# EAGLE board ExiaNona (EAGLE 9.6.2)
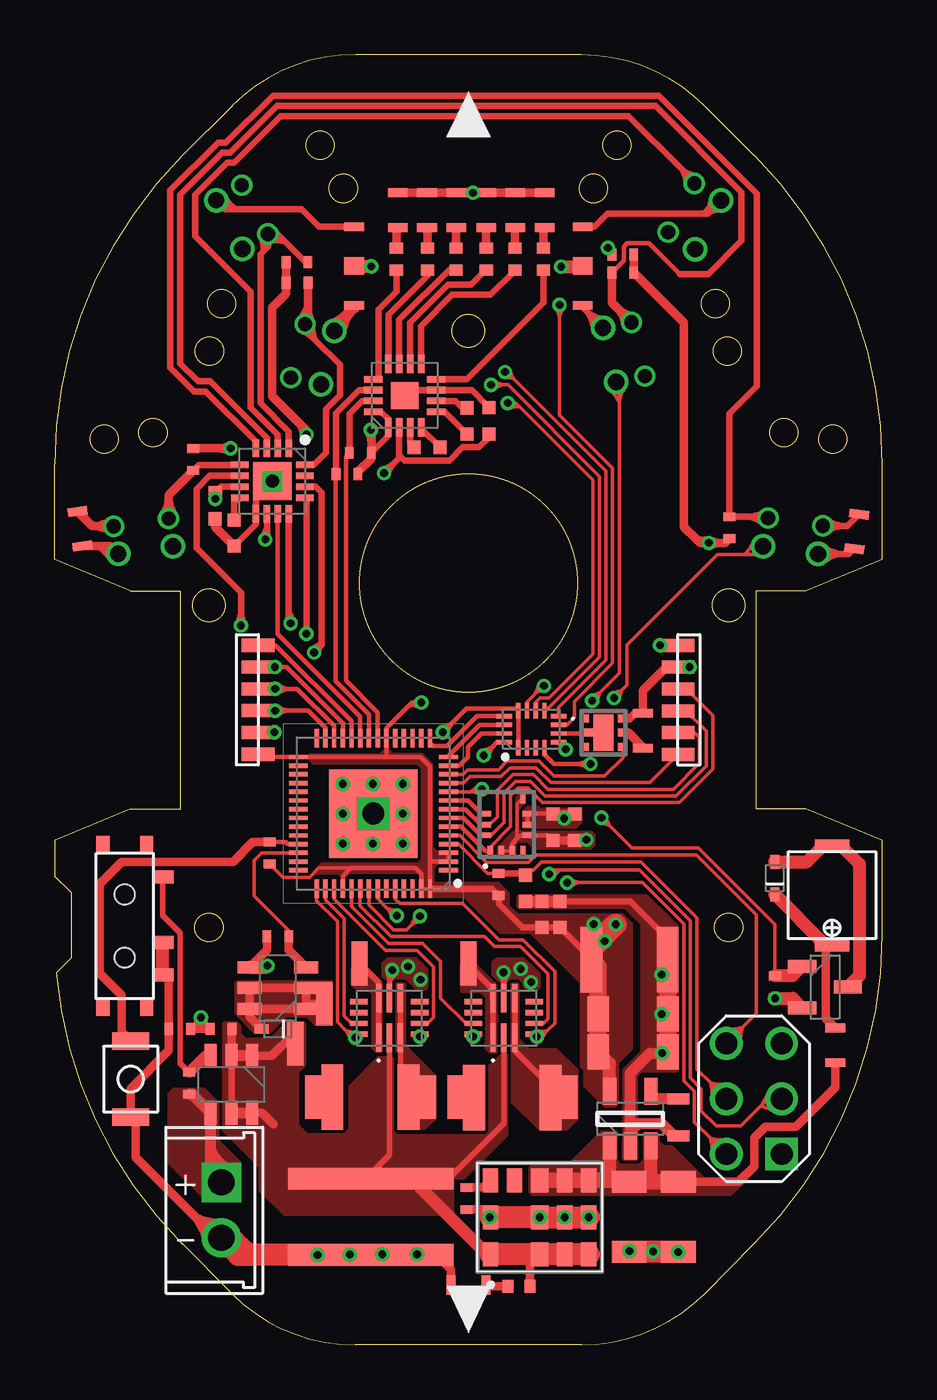
[diagram p2: board, top side]
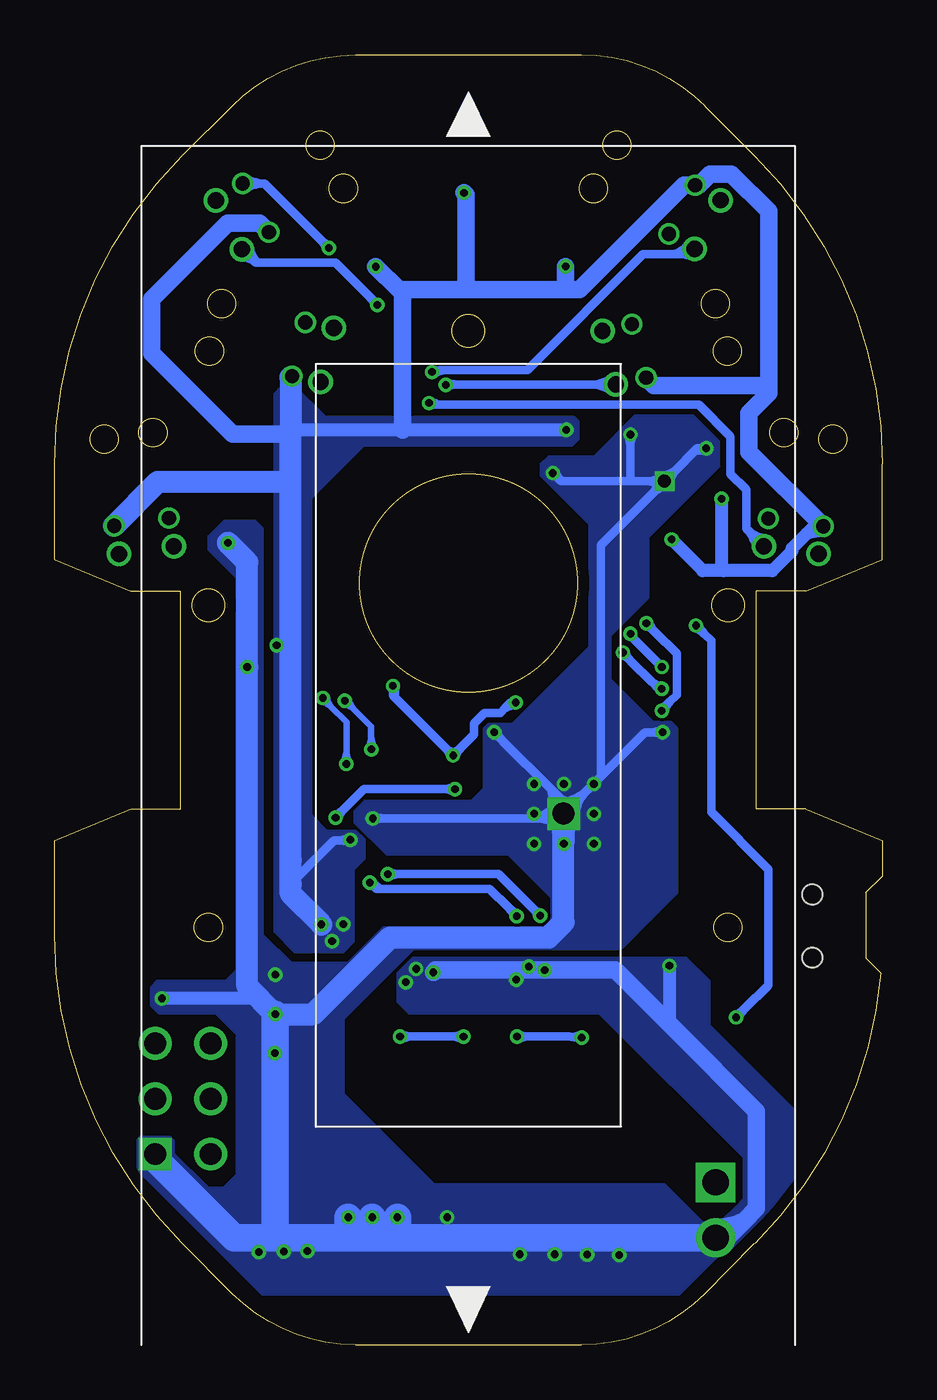
[diagram p3: board, bottom side, seen from below]

Size 38 x 59.22 mm. Coordinates in mm from the lower left corner, seen from the top.
Outline: 0,40.42 0,36.05 3.5,34.6 5.79,34.6 5.79,24.6 3.5,24.6 0,23.15 0,21.5 0.76,20.76 0.76,17.76 0.08,17.08 arc40 5.86,4.65
Outline: 29.84,2.35 32.13,4.66 arc45 37.99,18.81
Outline: 29.84,2.35 arc-45 24.18,0.01 13.82,0.01
Outline: 5.87,4.66 8.15,2.35 arc45 13.82,0
Outline: 38,18.81 38,23.15 34.49,24.6 32.21,24.6 32.21,34.6 34.49,34.6 38,36.05 38,40.42 arc45 32.13,54.57
Outline: 32.13,54.57 29.84,56.85 arc45 24.18,59.2
Outline: 8.15,56.85 5.87,54.57 arc45 0,40.42
Outline: 24.18,59.22 13.82,59.22 arc45 8.15,56.86
Outline: circle at 19,34.96 radius 5
Outline: circle at 30.94,19.16 radius 0.65
Outline: circle at 30.94,33.94 radius 0.75
Outline: circle at 7.09,19.16 radius 0.65
Outline: circle at 7.09,33.94 radius 0.75
Outline: circle at 19,46.54 radius 0.75
Outline: circle at 35.71,41.56 radius 0.65
Outline: circle at 33.48,41.87 radius 0.65
Outline: circle at 30.33,47.79 radius 0.65
Outline: circle at 25.81,55.05 radius 0.65
Outline: circle at 24.74,53.07 radius 0.65
Outline: circle at 2.29,41.56 radius 0.65
Outline: circle at 4.52,41.87 radius 0.65
Outline: circle at 30.89,45.6 radius 0.65
Outline: circle at 7.67,47.79 radius 0.65
Outline: circle at 12.19,55.05 radius 0.65
Outline: circle at 13.26,53.07 radius 0.65
Outline: circle at 7.11,45.6 radius 0.65
Copper layers (1*16): Top 0.035mm / dielectric 1.6mm / Bottom 0.035mm
Design rules "Elecrow_2-layer_PCB_eagle_rule *": minimum track width 6mil, minimum drill 12mil, track to track 6mil, track to pad 6mil, pad to pad 6mil, via to via 8mil, smd to smd 0mil, copper to edge 20mil, drill to drill 10mil, minimum pad ring 6mil, minimum via ring 6mil, stop-mask expansion 0mil, vias tented up to drill 100mil, thermal gap 0mil

## Footprints (pad centres in the part's own frame; a part is rotated, then mirrored left to right if it is on the bottom)
C3216 = smd 1 x 1.6: 1 -1.6,0; 2 1.6,0
R1005 = smd 0.6 x 0.6: P$1 -0.6,0; P$2 0.6,0
C1608 = smd 0.5 x 1: 1 -0.85,0; 2 0.85,0
HRCON-2 = drill 1.2 pad 1.778 square: 1 0,0 | drill 1.2 pad 1.778: 2 0,-2.54
SODFL1608X70N = smd 0.64 x 0.42: 1 -0.75,0; 2 0.75,0
QFN40P700X700X90-57N = smd 0.85 x 0.2: 1 -3.45,2.6; 2 -3.45,2.2; 3 -3.45,1.8; 4 -3.45,1.4; 5 -3.45,1; 6 -3.45,0.6; 7 -3.45,0.2; 8 -3.45,-0.2; 9 -3.45,-0.6; 10 -3.45,-1; 11 -3.45,-1.4; 12 -3.45,-1.8; 13 -3.45,-2.2; 14 -3.45,-2.6; 29 3.45,-2.6; 30 3.45,-2.2; 31 3.45,-1.8; 32 3.45,-1.4; 33 3.45,-1; 34 3.45,-0.6; 35 3.45,-0.2; 36 3.45,0.2; 37 3.45,0.6; 38 3.45,1; 39 3.45,1.4; 40 3.45,1.8; 41 3.45,2.2; 42 3.45,2.6 | smd 0.2 x 0.85: 15 -2.6,-3.45; 16 -2.2,-3.45; 17 -1.8,-3.45; 18 -1.4,-3.45; 19 -1,-3.45; 20 -0.6,-3.45; 21 -0.2,-3.45; 22 0.2,-3.45; 23 0.6,-3.45; 24 1,-3.45; 25 1.4,-3.45; 26 1.8,-3.45; 27 2.2,-3.45; 28 2.6,-3.45; 43 2.6,3.45; 44 2.2,3.45; 45 1.8,3.45; 46 1.4,3.45; 47 1,3.45; 48 0.6,3.45; 49 0.2,3.45; 50 -0.2,3.45; 51 -0.6,3.45; 52 -1,3.45; 53 -1.4,3.45; 54 -1.8,3.45; 55 -2.2,3.45; 56 -2.6,3.45 | smd 4.05 x 4.05: 57 0,0
QFN50P300X300X80-17N = smd 0.85 x 0.3: 1 -1.45,0.75; 2 -1.45,0.25; 3 -1.45,-0.25; 4 -1.45,-0.75; 9 1.45,-0.75; 10 1.45,-0.25; 11 1.45,0.25; 12 1.45,0.75 | smd 0.3 x 0.85: 5 -0.75,-1.45; 6 -0.25,-1.45; 7 0.25,-1.45; 8 0.75,-1.45; 13 0.75,1.45; 14 0.25,1.45; 15 -0.25,1.45; 16 -0.75,1.45 | smd 1.25 x 1.25: 17 0,0
LGA-14(2.5X3X0.86) = smd 0.475 x 0.25: 1 -1.212,0.75; 2 -1.212,0.25; 3 -1.212,-0.25; 4 -1.212,-0.75; 8 1.212,-0.75 | smd 0.25 x 0.475: 5 -0.5,-0.963; 6 0,-0.963; 7 0.5,-0.963; 12 0.5,0.963; 13 0,0.963; 14 -0.5,0.963
SOT95P275X110-5N = smd 1.25 x 0.6: 1 -1.25,0.95; 2 -1.25,0; 3 -1.25,-0.95; 4 1.25,-0.95; 5 1.25,0.95
MP6551GQBP = smd 1.3 x 0.25: 1 -0.9,0.5; 2 -0.9,0; 3 -0.9,-0.5; 8 0.9,-0.5; 9 0.9,0; 10 0.9,0.5 | smd 0.25 x 0.8: 4 -0.75,-1.4; 5 -0.25,-1.4; 6 0.25,-1.4; 7 0.75,-1.4; 11 0.75,1.4; 12 0.25,1.4; 13 -0.25,1.4; 14 -0.75,1.4
BCR421UFD7 = smd 0.37 x 0.45: 1 -0.65,-0.886; 3 0.65,-0.886; 4 0.65,0.886; 5 0,0.886; 6 -0.65,0.886 | smd 0.37 x 0.6: 2 0,-0.75 | smd 1.67 x 0.9: 7 0,0
QFN50P300X300X80-17N' = smd 0.8 x 0.3: 1 -1.5,0.75; 2 -1.5,0.25; 3 -1.5,-0.25; 4 -1.5,-0.75; 9 1.5,-0.75; 10 1.5,-0.25; 11 1.5,0.25; 12 1.5,0.75 | smd 0.3 x 0.8: 5 -0.75,-1.5; 6 -0.25,-1.5; 7 0.25,-1.5; 8 0.75,-1.5; 13 0.75,1.5; 14 0.25,1.5; 15 -0.25,1.5; 16 -0.75,1.5 | smd 1.75 x 1.75: 17 0,0
QFN40P180X260X55-16N = smd 0.7 x 0.2: 1 -0.85,0.6; 2 -0.85,0.2; 3 -0.85,-0.2; 4 -0.85,-0.6; 9 0.85,-0.6; 10 0.85,-0.2; 11 0.85,0.2; 12 0.85,0.6 | smd 0.2 x 0.7: 5 -0.6,-1.25; 6 -0.2,-1.25; 7 0.2,-1.25; 8 0.6,-1.25; 13 0.6,1.25; 14 0.2,1.25; 15 -0.2,1.25; 16 -0.6,1.25
LTR4206E = drill 0.65 pad 0.9: 1 -1.27,0; 2 1.27,0
SOT95P284X110-6N = smd 1.1 x 0.55: 1 -1.3,0.95; 2 -1.3,0; 3 -1.3,-0.95; 4 1.3,-0.95; 5 1.3,0; 6 1.3,0.95
SOT95P237X112-3N = smd 1.3 x 0.6: 1 -1.05,0.95; 2 -1.05,-0.95; 3 1.05,0
R1005' = smd 0.4 x 0.55: P$1 -0.502,0; P$2 0.501,0
R1608 = smd 0.4 x 0.9: 1 -0.8,0; 2 0.8,0
LXDC55FAAA203 = smd 0.7 x 1.1: 1 0,0; 4 -3.4,0; 5 -4.5,0; 6 -4.5,-1.7; 7 -4.5,-3.4; 8 -3.4,-3.4; 10 -1.1,-3.4; 11 0,-3.4; 12 0,-1.7; 14 -3.4,-1.7 | smd 0.8 x 1.1: 3 -2.25,0; 9 -2.25,-3.4; 13 -2.25,-1.7
PAD = smd 0.75 x 2: P$1 0,0
LED_1005 = smd 0.5 x 0.6: P$1 -0.5,0; P$2 0.5,0
PANA = smd 1 x 3: P$1 -1.75,0; P$2 1.75,0
SFH_4550 = drill 0.75: ANODE -1.27,0; CASODE 1.27,0
PIN2_3 = drill 1 square: P$1 0,0 | drill 1: P$2 2.54,0; P$3 5.08,0; P$4 0,2.54; P$5 2.54,2.54; P$6 5.08,2.54
BUZZER = smd 0.635 x 1.6: + 4.25,2; - -0.25,2
ENCORDER_R = smd 0.6 x 1.5: P$1 -2.5,-1; P$2 -1.5,-1; P$3 -0.5,-1; P$4 0.5,-1; P$5 1.5,-1; P$6 2.5,-1
TVAF06 = smd 1.7 x 0.8: P$1 1.45,3.25; P$2 1.45,-0.25
SWITCH = smd 0.75 x 0.6: P$1 -0.4,0.3; P$2 -0.4,2.3; P$3 7.1,0.3; P$4 7.1,2.3 | smd 0.6 x 1: P$5 5.6,3.05; P$6 4.1,3.05; P$7 1.1,3.05 | hole 0.9: 1.9,1.3; 4.8,1.3

## Placement (x,y rotation side)
C1  [C3216]  26.38,5.88 90 top
C2  0.1u  [R1005]  23.2,19.76 90 top
C3  0.1u  [R1005]  22.38,19.76 90 top
C4  [C3216]  26.55,13.45 180 top
C5  0.1u  [R1005]  21.62,20.96 90 top
C6  [C3216]  28.63,5.88 90 top
C7  1u  [R1005]  17.09,41.19 0 top
C9  [C1608]  28.64,10.44 90 top
C10  0.1u  [R1005]  8.25,37.26 270 top
C11  1u  [R1005]  18.94,42.4 90 top
C12  100nF  [R1005]  22.88,23.76 90 top
C13  0.1u  [R1005]  7.38,38.51 270 top
C14  [C3216]  26.55,15.2 180 top
C16  1u  [R1005]  19.94,42.4 270 top
C21  100nF  [R1005]  23.88,23.76 90 top
CN2  [HRCON-2]  7.66,7.46 0 top
D1  RB520S30T5G  [SODFL1608X70N]  33.05,21.42 90 top
D2  RB520S30T5G  [SODFL1608X70N]  10.25,14.51 180 top
IC1  ESP32-S3-WROOM-1-N8  [QFN40P700X700X90-57N]  14.63,24.38 180 top
IC2  MAX8647ETE+  [QFN50P300X300X80-17N]  16.07,43.57 90 top
IC3  LSM6DS3USTR  [LGA-14(2.5X3X0.86)]  20.75,23.88 90 top
IC4  NCV8163ASN330T1G  [SOT95P275X110-5N]  26.43,10.39 90 top
IC5  MP6551GQB-P  [MP6551GQBP]  15.38,15.01 90 top
IC6  MP6551GQB-P  [MP6551GQBP]  20.62,15.01 90 top
IC7  BCR421UFD-7  [BCR421UFD7]  25.19,28.1 270 top
IC8  ADS7038IRTER  [QFN50P300X300X80-17N']  10,39.63 270 top
IC10  TMUX1108RSVR  [QFN40P180X260X55-16N]  21.89,28.26 90 top
Q1  LTR-4206E  [LTR4206E]  3.98,37.75 188 top
Q2  SI3493DDV-T1-GE3  [SOT95P284X110-6N]  8.12,11.96 270 top
Q3  IRFML8244TRPBF  [SOT95P237X112-3N]  35.36,16.43 0 top
Q4  LTR-4206E  [LTR4206E]  11.17,45.61 285 bottom
Q5  SI3460DDV-T1-GE3  [SOT95P284X110-6N]  10.25,16.38 180 top
Q7  LTR-4206E  [LTR4206E]  34,37.77 352 top
Q8  LTR-4206E  [LTR4206E]  26.79,45.69 284 top
Q10  LTR-4206E  [LTR4206E]  28.76,52.18 241.8 top
Q11  LTR-4206E  [LTR4206E]  9.2,52.1 118.2 top
R1  10k  [R1005']  20.38,21.13 90 top
R2  3k  [R1005']  7.65,14.51 180 top
R3  1k  [R1005']  5.75,14.52 180 top
R4  1k  [R1005']  26.08,50.03 180 top
R5  0.5k  [R1005']  18.9,6.72 270 top
R6  18  [R1608]  19,2.76 0 top
R7  10k  [R1005']  6.19,12.01 270 top
R8  10k  [R1005']  9.86,22.58 270 top
R9  10k  [R1005']  33.07,16.44 270 top
R10  18  [R1608]  35.84,13.75 90 top
R11  18  [R1608]  24.25,50.51 90 top
R12  10k  [R1005']  14.04,40.94 180 top
R13  10k  [R1005']  13.42,39.97 0 top
R14  18  [R1608]  13.75,50.51 90 top
R15  18  [R1608]  24.25,48.51 270 top
R16  1k  [R1005']  26.09,49.21 180 top
R17  1k  [R1005']  11.13,48.74 0 top
R18  1k  [R1005']  6.37,40.64 270 top
R19  18  [R1608]  27.01,28.19 270 top
R20  1k  [R1005']  11.13,49.68 0 top
R21  10k  [R1005']  10.25,18.76 180 top
R22  1k  [R1005']  30.97,37.51 90 top
R25  18  [R1608]  1.17,37.46 278 top
R26  18  [R1608]  36.82,37.33 262 top
R27  18  [R1608]  22.5,52.07 90 top
R28  18  [R1608]  21.15,52.07 90 top
R29  18  [R1608]  13.75,48.51 270 top
R30  18  [R1608]  19.81,52.07 90 top
R31  18  [R1608]  18.44,52.07 90 top
R32  18  [R1608]  17.1,52.07 90 top
R33  18  [R1608]  15.75,52.07 90 top
U1  LXDC55FAAA-203  [LXDC55FAAA203]  20.01,4.16 180 top
U$1  PAD  [PAD]  18.42,11.38 0 top
U$2  LED_1005  [LED_1005]  21.32,2.7 180 top
U$3  PANA  [PANA]  14.5,11.38 180 top
U$4  SFH4550  [SFH_4550]  33.78,36.47 172 top
U$5  PANA  [PANA]  14.28,5.88 90 top
U$6  PIN2_3  [PIN2_3]  33.38,8.76 90 top
U$7  PANA  [PANA]  21.01,11.36 180 top
U$8  PAD  [PAD]  23.64,11.38 0 top
U$9  PAD  [PAD]  17.12,11.38 0 top
U$10  SFH4550  [SFH_4550]  25.48,45.43 284 top
U$11  PAD  [PAD]  11.88,11.38 0 top
U$12  PANA  [PANA]  16.81,5.88 90 top
U$13  BUZZER_44  [BUZZER]  33.69,22.64 270 top
U$14  SFH4550  [SFH_4550]  12.54,45.31 284 bottom
U$15  ENCORDER_1  [ENCORDER_R]  8.35,29.61 90 top
U$16  PANA  [PANA]  12.22,5.88 90 top
U$17  PAD  [PAD]  19,17.51 0 top
U$18  SFH4550  [SFH_4550]  30,51.4 241.8 top
U$19  LED_1005  [LED_1005]  19.81,49.82 270 top
U$20  PAD  [PAD]  11.05,13.83 180 top
U$21  LED_1005  [LED_1005]  18.44,49.82 270 top
U$22  SFH4550  [SFH_4550]  8.02,51.41 298.2 top
U$23  LED_1005  [LED_1005]  17.12,49.82 270 top
U$24  PANA  [PANA]  26.39,17.68 180 top
U$25  LED_1005  [LED_1005]  21.12,49.82 270 top
U$27  PAD  [PAD]  14,17.51 180 top
U$28  ENCORDER_1  [ENCORDER_R]  29.62,29.6 270 top
U$30  LED_1005  [LED_1005]  15.69,49.82 270 top
U$31  LED_1005  [LED_1005]  22.44,49.82 270 top
U$43  TVAF06  [TVAF06]  2.05,10.7 0 top
U$44  SFH4550  [SFH_4550]  4.18,36.47 8 top
U$53  SWICH  [SWITCH]  1.92,22.58 270 top
U$58  PAD  [PAD]  12.38,15.66 180 top

## Tracks (layer width: path | path; a pad name or v marks a point on that pad's centre or on a via)
+3V3  (via drill 0.35)
  Top 0.152: IC3.2 IC3.3 | 21.24,23.24 21.24,24.83 IC3.8 | 17,52.87 R32.2 | 16.84,21.01 IC1.55 IC1.56 | 16.8,26.98 15.24,26.98 | 15.24,26.98 IC1.29 | 15.23,26.99 15.24,26.98 | 13.78,21.88 12.13,21.88 11.7,21.46 10.49,21.46 R8.P$2 | IC10.11 21.68,29.51 22.05,29.88 | 22.05,29.88 22.41,30.24 v22.46,30.24 | 22.07,29.92 arc-29 22.52,30.04 v22.46,30.24 | 22.05,29.88 22.07,29.92 | 22.07,29.92 arc29 22.23,30.34 v22.46,30.24
  Top 0.2: U$15.P$1 9.47,26.98 IC1.29 16.8,26.98 17.23,26.56 17.23,22.2 | 17.23,22.2 IC1.56 | 17.23,22.2 17.25,22.18 IC1.2 IC1.3 | IC1.46 13.23,21.52 13.6,21.88 13.78,21.88 16.58,21.88 16.84,21.62 16.84,21.01 | IC10.16 20.31,27.66 20.1,27.45 | 20.1,27.45 v19.7,27.05 | IC3.3 21,23 21.24,23.24 21.38,23.38 IC3.5 22.65,23.38 C12.P$1 | 23.76,23.16 23.86,23.16 | 23.86,23.16 C21.P$1 | v16.84,29.48 16.4,29.48 16.29,29.37 | 16.29,29.37 15.23,28.32 IC1.20 15.23,26.99 | R11.1 24.25,49.4 R15.1 | R14.1 13.75,49.48 R29.1 | 20.1,27.45 arc-29 19.62,27.26 v19.7,27.05 | 20.1,27.45 arc29 19.92,26.97 v19.7,27.05 | 23.86,23.16 arc-29 24.33,22.97 v24.42,23.18 24.32,23.38 arc-29 23.86,23.16 | 16.29,29.37 arc-29 16.79,29.26 v16.84,29.48 | 16.29,29.37 arc29 16.7,29.67 v16.84,29.48
  Top 0.3: R12.P$1 15.32,41.72 IC2.1 15.32,42.49 15,42.82 IC2.16 | Q7.2 36.09,37.59 | 36.09,37.59 36.39,37.59 R26.1 | 7.6,39.34 C13.P$1 v7.38,38.83 | 7.6,39.34 7.65,39.38 IC8.7 | U$28.P$1 28.36,32.1 | 28.36,32.1 v27.81,32.1 v27.8,32.11 | IC8.10 9.75,37.51 | 9.75,37.51 9.75,37.04 v9.67,36.96 | 14.54,41.96 v14.51,41.99 | 28.36,32.1 arc-29 27.86,32.28 v27.8,32.11 | 28.36,32.1 arc29 27.86,31.94 v27.8,32.11 | 9.75,37.51 arc-29 9.51,37.04 v9.67,36.96 | 9.75,37.51 arc29 9.85,37 v9.67,36.96 | 7.6,39.34 arc-29 7.25,38.95 v7.38,38.83 | 7.6,39.34 arc29 7.55,38.81 v7.38,38.83 | 36.09,37.59 arc-29 35.4,37.9 Q7.2 | 36.09,37.59 arc29 35.4,37.28 Q7.2
  Top 0.305: U$24.P$2 24.64,17.71 C2.P$1 C3.P$1 21.48,19.16 20.4,20.23 20.4,20.61 | R1.P$1 20.08,20.93 IC1.56
  Top 0.4: R33.2 17,52.87 | R32.2 R31.2 18.65,52.87 | 18.65,52.87 v19.21,52.87 | v19.21,52.87 19.76,52.87 | 19.76,52.87 R30.2 R28.2 R27.2 | 20.4,20.61 R1.P$1 | Q1.2 1.89,37.57 | 1.89,37.57 1.74,37.57 R25.1 | C12.P$1 23.76,23.16 | v24.42,23.18 24.1,23.18 24.09,23.19 23.9,23.19 C21.P$1 | R13.P$2 13.93,40.07 14.54,40.69 R12.P$1 14.54,41.44 | 14.54,41.44 14.54,41.96 | 14.54,41.44 arc-29 14.64,41.97 v14.51,41.99 14.39,41.96 arc-29 14.54,41.44 | 18.65,52.87 arc-29 19.18,52.75 v19.21,52.87 | 18.65,52.87 arc29 19.18,53 v19.21,52.87 | 19.76,52.87 arc-29 19.23,53 v19.21,52.87 | 19.76,52.87 arc29 19.23,52.75 v19.21,52.87 | 1.89,37.57 arc-29 2.62,37.3 Q1.2 | 1.89,37.57 arc29 2.62,37.84 Q1.2
  Top 0.6: IC4.5 25.48,12.92 C4.2 | v23.25,49.48 24.16,49.48 24.25,49.4 | v14.54,49.49 13.76,49.49 13.75,49.48
  Top 0.8: C4.2 C14.2 24.95,17.1 24.95,17.38 U$24.P$2
  Top 1: U$24.P$2 24.64,18.19 v25.75,19.3
  Bottom 0.2: Q8.2 27.16,44.39
  Bottom 0.3: v27.8,32.11 27.25,32.11 | 27.25,32.11 27.16,32.11 | 27.25,32.11 arc-29 27.75,31.94 v27.8,32.11 | 27.25,32.11 arc29 27.75,32.28 v27.8,32.11
  Bottom 0.4: v24.42,23.18 24.44,23.16 24.97,23.16 | 27.16,22.25 | 27.16,21.15 25.16,23.16 24.97,23.16 | v19.7,27.05 20.1,27.45 | 20.1,27.45 22.35,29.7 | 22.35,29.7 22.46,29.81 v22.46,30.24 | v16.84,29.48 17.06,29.48 17.32,29.22 | v19.7,27.05 19.31,27.45 | 19.31,27.45 18.75,28.01 18.75,28.51 18.25,29.01 17.53,29.01 17.32,29.22 | 20.1,27.45 arc-29 19.64,27.16 v19.7,27.05 | 20.1,27.45 arc29 19.81,26.99 v19.7,27.05 | 19.31,27.45 arc-29 19.6,26.99 v19.7,27.05 | 19.31,27.45 arc29 19.77,27.16 v19.7,27.05 | 24.97,23.16 arc-29 24.45,23.3 v24.42,23.18 | 24.97,23.16 arc29 24.44,23.06 v24.42,23.18 | 17.32,29.22 arc-29 16.92,29.58 v16.84,29.48 | 17.32,29.22 arc29 16.8,29.36 v16.84,29.48 | 22.35,29.7 arc-29 22.58,30.19 v22.46,30.24 | 22.35,29.7 arc29 22.34,30.24 v22.46,30.24
  Bottom 0.6: v14.51,41.99 22.03,41.99 26.97,41.99 27.16,41.8 | Q1.2 3.13,37.57 3.47,37.23 | v9.67,36.96 8.24,35.53 7.3,35.53 | 3.47,37.23 4.16,36.55 4.16,36.44 5.06,35.53 7.3,35.53 | 7.3,35.53 7.38,35.61 v7.38,38.83 | 3.47,37.23 arc-29 2.83,37.72 Q1.2 | 3.47,37.23 arc29 2.68,37.39 Q1.2
  Bottom 0.8: Q10.2 28.58,51.48 30.05,51.48 33.53,48 33.53,45.51 29.82,41.8 27.16,41.8 | Q10.2 | 14.54,48.42 13.91,48.42 9.11,53.22 Q11.2 8.43,53.22 7.92,53.73 6.92,53.73 5.21,52.02 5.21,43.67 | 14.54,48.42 19.12,48.42 | 21.78,48.42 22.03,48.17 22.03,41.99 | 19.12,48.42 21.78,48.42 | 21.78,48.42 22.19,48.42 v23.25,49.48 | v14.54,49.49 14.54,48.42 | 19.12,48.42 19.12,52.78 v19.21,52.87 | Q1.2 6.13,40.98 6.13,42.76 5.21,43.67 | Q4.2 10.48,44.02 5.56,44.02 5.21,43.67
  Bottom 1: Q7.2 33.24,39.61 27.29,39.61 27.16,39.73 | v25.75,19.3 27.16,20.71 27.16,21.15 27.16,22.25 | 27.16,22.25 27.16,32.11 27.16,39.73 | 27.16,39.73 27.16,41.8 27.16,44.39
  other vias: 24.75,19.31 25.26,18.53
  pour Top: 25.27,10.91 24.3,11.88 24.3,12.6 24.14,12.76 24.14,16.6 21.88,18.86 20.48,18.86 18.83,20.51 16.87,20.51 16.73,20.65 16.73,21.19 16.79,21.25 20.37,21.25 20.86,20.76 20.86,20.17 21.24,19.8 26.07,19.8 26.52,19.35 26.52,13.56 25.89,12.93 25.89,11.06 25.73,10.91
  pour Top: 20.31,22.45 20.38,22.38 21.13,22.38 21.19,22.43 21.19,22.95 21.31,23.07 21.69,23.07 22,22.77 24.64,22.77 24.82,22.95 24.82,23.41 24.66,23.57 21.44,23.57 21.31,23.71 21.31,24.58 21.62,24.89 21.62,25.28 21.57,25.33 21.32,25.33 21.07,25.08 21.07,23.66 20.31,22.9
  pour Bottom: 24.23,18.52 24.23,21.83 23.73,22.32 23.73,23.2 24.15,23.62 25.48,23.62 26.18,24.32 26.18,38.85 23.78,41.25 14.23,41.25 13.92,41.56 13.92,42.37 14.14,42.59 25.53,42.59 26.95,44.01 27.59,44.01 27.95,43.64 27.95,18.98 27,18.03 24.7,18.03 24.22,18.51
  pour Top: 16.76,21.19 16.76,26.51 16.63,26.64 11.88,26.64 11.62,26.91 11.62,27.03 11.73,27.15 14.93,27.15 15.19,27.4 15.28,27.4 15.52,27.16 16.87,27.16 17.36,26.68 17.36,22.88 17.55,22.68 18,22.68 18.19,22.5 18.19,22.26 18.05,22.12 17.68,22.12 17.43,21.87 17.43,21.2 17.32,21.09 16.86,21.09 16.77,21.18
  pour Top: 13.14,21.47 13.03,21.58 12.58,21.58 12.03,21.58 11.98,21.63 11.98,21.84 12.05,21.91 12.29,22.15 16.79,22.15 16.9,22.04 16.9,21.92 16.9,21.64 16.87,21.61 15.98,21.61 13.49,21.61 13.35,21.47 13.15,21.47
+5V
  Top 0.4: R10.1 35.83,12.95 35.83,11.82 34.02,10.01 32.63,10.01 32.11,9.5 32.11,8.21 31.39,7.48 C6.2
  Top 0.6: IC4.1 25.48,7.58 25.5,7.56 | 27.25,7.48 27.38,7.61 IC4.3
  Top 0.7: U1.9 U1.8 U1.7 25.5,7.56 26.3,7.56 C1.2 27.25,7.48 C6.2
  pour Top: 21.74,7.03 21.91,6.87 31.07,6.87 31.88,7.68 29.82,7.68 28.37,9.13 27.98,9.13 27.76,9.35 27.76,9.69 27.69,9.77 27.07,9.77 27.01,9.71 27.01,8.48 26.83,8.3 26,8.3 25.83,8.47 25.83,9.76 25.79,9.8 25.09,9.8 23.59,8.3 21.93,8.3 21.74,8.11
A_CW_CCW
  Top 0.152: IC1.44 12.43,20.43 13.29,19.58 13.29,15.1 13.63,14.76 IC5.13
A_CW_CCW2
  Top 0.152: IC1.45 12.83,20.48 15.2,18.11 16.64,18.11 17.4,17.35 17.4,15.04 17.12,14.76 IC5.5
A_PWM  (via drill 0.35)
  Top 0.152: IC1.43 12.03,20.39 12.98,19.44 12.98,14.82 13.34,14.47 | IC5.14 13.54,14.26 13.39,14.4 | 13.39,14.4 13.34,14.46 13.34,14.47 | 13.34,14.47 13.35,14.46 arc29 13.86,14.34 v13.81,14.11 13.57,14 arc29 13.39,14.4
  Top 0.25: IC5.14 13.96,14.26 v13.81,14.11 | v16.77,14.15 IC5.4
  Bottom 0.4: 16.22,14.15 14.37,14.15 14.27,14.13 | 16.22,14.15 v16.77,14.15 | 14.27,14.13 arc-29 13.84,14.23 v13.81,14.11 13.82,14.03 arc-29 14.27,14.13 | 16.22,14.15 arc-29 16.75,14.03 v16.77,14.15 | 16.22,14.15 arc29 16.75,14.28 v16.77,14.15
ADC_CS
  Top 0.2: IC1.23 14.03,28.83 10.25,32.62 IC8.11
B_CW_CCW
  Top 0.152: IC1.48 14.03,20.16 15.44,18.75 19.73,18.75 20.19,18.29 21.38,18.29 22.65,17.02 22.65,14.96 22.45,14.76 IC6.5
B_CW_CCW1
  Top 0.152: IC1.47 13.63,20.12 15.33,18.43 16.89,18.43 17.72,17.6 17.72,15.91 18.88,14.76 IC6.13
B_PWM  (via drill 0.35)
  Top 0.152: IC1.52 15.63,20.47 15.85,20.26 18.73,20.26 20.39,18.6 21.51,18.6 22.96,17.15 22.96,14.77 22.62,14.43 | 22.62,14.43 22.45,14.26 22.14,14.26 IC6.4 | 22.62,14.43 arc-29 22.12,14.41 v22.14,14.15 22.35,14.02 arc-29 22.62,14.43
  Top 0.25: IC6.14 v19.23,14.15 | v22.14,14.15 22.14,14.26
  Bottom 0.4: v19.23,14.15 19.78,14.15 | 19.78,14.15 21.58,14.15 | 21.58,14.15 v22.14,14.15 | 19.78,14.15 arc-29 19.25,14.28 v19.23,14.15 | 19.78,14.15 arc29 19.25,14.03 v19.23,14.15 | 21.58,14.15 arc-29 22.11,14.03 v22.14,14.15 | 21.58,14.15 arc29 22.11,14.28 v22.14,14.15
BATTERY  (via drill 0.35)
  Top 0.3: IC8.6 7.12,39.88 6.52,39.28 6.52,36.57 8.56,34.53 8.56,33.57 | v8.56,33.01 8.56,33.57 | v6.72,15.04 6.72,14.57 6.67,14.52 | R2.P$2 7.1,14.51 7.1,14.52 | 8.56,33.57 arc-29 8.39,33.07 v8.56,33.01 | 8.56,33.57 arc29 8.73,33.07 v8.56,33.01
  Top 0.4: R3.P$1 6.52,14.52 | 6.52,14.52 6.67,14.52 6.92,14.52 | 7.1,14.52 6.92,14.52 | 6.52,14.52 arc-29 6.83,14.96 v6.72,15.04 | 6.52,14.52 arc29 6.59,15.05 v6.72,15.04 | 6.92,14.52 arc-29 6.85,15.05 v6.72,15.04 | 6.92,14.52 arc29 6.62,14.96 v6.72,15.04
  Bottom 0.4: v6.72,15.04 6.33,15.43 | 6.33,15.43 5.24,16.51 5.24,21.83 7.86,24.45 7.86,32.31 8.16,32.62 | 8.16,32.62 v8.56,33.01 | 6.33,15.43 arc-29 6.61,14.97 v6.72,15.04 | 6.33,15.43 arc29 6.79,15.14 v6.72,15.04 | 8.16,32.62 arc-29 8.63,32.91 v8.56,33.01 | 8.16,32.62 arc29 8.45,33.08 v8.56,33.01
BUZZER  (via drill 0.35)
  Top 0.152: IC1.10 19.07,25.38 | 19.07,25.38 19.49,25.38 v19.62,25.51 | R9.P$1 33.07,19.3 29.56,22.8 26.5,22.8 25.49,23.81 | v25.1,24.2 25.49,23.81 | 19.07,25.38 arc-29 19.56,25.27 v19.62,25.51 | 19.07,25.38 arc29 19.45,25.7 v19.62,25.51 | 25.49,23.81 arc-29 25.34,24.28 v25.1,24.2 | 25.49,23.81 arc29 25.02,23.96 v25.1,24.2
  Top 0.6: Q3.1 33.87,16.94 R9.P$1
  Bottom 0.4: v25.1,24.2 24.71,24.59 | 24.71,24.59 23.79,25.51 20.17,25.51 | 20.17,25.51 v19.62,25.51 | 20.17,25.51 arc-29 19.64,25.63 v19.62,25.51 | 20.17,25.51 arc29 19.64,25.39 v19.62,25.51 | 24.71,24.59 arc-29 24.99,24.13 v25.1,24.2 | 24.71,24.59 arc29 25.17,24.31 v25.1,24.2
EN
  Top 0.152: R1.P$2 19.88,21.64 18.53,22.98 IC1.4 | U$6.P$5 30.09,12.04 | 30.09,12.04 29.49,12.64 29.49,19.59 26.91,22.17 22.34,22.17 21.95,21.78 21.85,21.78 C5.P$2 | 30.09,12.04 arc-29 30.16,11.24 U$6.P$5 | 30.09,12.04 arc29 30.89,11.97 U$6.P$5
  Top 0.3: R1.P$2 21.54,21.64
  Top 0.4: 21.54,21.64 C5.P$2
EN_CLK
  Top 0.152: U$28.P$5 29.37,28.1 29.6,27.87 29.6,26.71 28.39,25.5 22.65,25.5 21.97,26.18 21.03,26.18 20.32,25.47 20.32,24.23 19.97,23.88 IC3.13
  Top 0.2: IC3.13 19.57,23.88 18.86,24.58 IC1.8
EN_GN_SSL
  Top 0.2: IC1.9 18.98,24.98 19.58,24.38 IC3.12
EN_MISO
  Top 0.152: U$28.P$3 29,30.1 30.21,28.89 30.21,26.43 28.67,24.89 22.39,24.89 21.72,25.56 21.38,25.56 | IC3.1 20,22.86 20.93,23.79 20.93,25.21 21.28,25.56 21.38,25.56 | 21.38,25.56
  Top 0.2: IC3.1 19.78,22.67 18.67,23.78 IC1.6
EN_MOSI
  Top 0.152: U$28.P$4 28.99,29.1 29.91,28.18 29.91,26.57 28.53,25.19 22.52,25.19 21.84,25.87 21.25,25.87 21.15,25.87 20.62,25.34 20.62,23.98 20.03,23.38 IC3.14
  Top 0.2: IC3.14 19.57,23.38 18.77,24.18 IC1.7
ENC_L_CS
  Top 0.152: 9.56,32.11 U$15.P$6
  Top 0.2: IC1.24 13.63,28.62 10.15,32.11 9.56,32.11
ENC_R_CS
  Top 0.152: U$28.P$6 27.32,25.8 22.79,25.8 22.1,26.49 20.9,26.49 20.5,26.08 19.08,26.08 18.78,25.78 IC1.11
GND  (via drill 0.35, 0.6, 1)
  Top 0.152: 9.25,38.01 IC8.9 | C6.1 v28.62,4.27
  Top 0.2: IC10.1 IC10.12 21.18,29.21 18.91,29.21 18.21,28.51 | C12.P$2 22.85,24.38 IC3.7 IC3.6 | C12.P$2 | 18.21,28.51 v17.82,28.12 | Q5.4 9.22,17.33 | 9.22,17.33 9.71,17.33 | 18.21,28.51 arc-29 17.74,28.33 v17.82,28.12 | 18.21,28.51 arc29 18.03,28.04 v17.82,28.12 | C12.P$2 arc-29 23.23,24 v23.39,24.16 23.38,24.39 arc-29 C12.P$2 | 9.22,17.33 arc-29 9.71,17.18 v9.78,17.4 9.66,17.6 arc-29 9.22,17.33
  Top 0.25: IC5.9 15.38,16.66 | 15.38,16.66 15.38,17.08 v15.5,17.21 | IC6.9 20.62,16.54 | 20.62,16.54 20.62,17.08 v20.61,17.1 | 15.38,16.66 arc-29 15.66,17.09 v15.5,17.21 | 15.38,16.66 arc29 15.3,17.18 v15.5,17.21 | 20.62,16.54 arc-29 20.8,17.03 v20.61,17.1 | 20.62,16.54 arc29 20.42,17.02 v20.61,17.1
  Top 0.3: IC2.2 15.82,41.26 15.82,40.83 16.07,40.59 18.12,40.59 18.73,41.2 19.49,41.2 19.94,41.65 C16.P$2 | IC8.9 9.25,38.88 9.46,39.09 | 9.46,39.09 IC8.17 | 28.03,31.1 28.6,31.1 | 28.6,31.1 U$28.P$2 29.15,31.1 v29.16,31.11 | 9.46,39.09 arc-29 10.11,39.35 IC8.17 | 9.46,39.09 arc29 9.72,39.75 IC8.17 | 28.6,31.1 arc-29 29.1,30.94 v29.16,31.11 | 28.6,31.1 arc29 29.1,31.28 v29.16,31.11
  Top 0.305: 28.15,18.64 26.44,20.36 C2.P$2 | v15.12,40.01 15.52,40.4 | 15.52,40.4 15.82,40.71 15.82,41.26 | C10.P$2 9.25,37.66 9.25,38.01 | 15.52,40.4 arc-29 15.05,40.17 v15.12,40.01 | 15.52,40.4 arc29 15.28,39.93 v15.12,40.01
  Top 0.4: CN2.2 7.42,4.92 6.46,5.87 | 6.46,5.87 3.72,8.61 3.72,10.45 U$43.P$2 3.5,11.76 5.25,13.51 R3.P$2 5.25,16.83 5.1,16.98 U$53.P$5 | 8.82,3.92 8.65,3.92 7.7,4.87 CN2.2 | 11.56,3.92 12.01,3.92 U$16.P$1 12.63,4.13 | 12.63,4.13 U$5.P$1 16.08,4.13 | 16.08,4.13 U$12.P$1 | U1.12 19.65,6.22 19.55,6.22 | 19.55,6.22 R5.P$2 | Q3.2 33.85,15.94 33.62,15.94 | 33.62,15.94 R9.P$2 | C12.P$2 C21.P$2 23.58,24.36 v23.39,24.16 | U$15.P$2 9.53,28.11 | 9.53,28.11 v10.08,28.11 v10.09,28.11 | R18.P$1 6.38,41.15 7.53,41.15 | 7.53,41.15 v8.08,41.15 | 29.5,36.94 28.89,37.54 28.89,46.9 R16.P$1 R4.P$1 | 29.5,36.94 29.63,36.8 v30.03,36.8 | R22.P$1 30.77,36.8 30.59,36.8 | 30.59,36.8 v30.03,36.8 | R20.P$1 R17.P$1 10.63,48.26 10.61,48.24 10.61,48.21 9.99,47.6 9.99,43.54 11.28,42.25 | 11.28,42.25 11.57,41.97 v11.57,41.77 | IC7.6 26.39,28.75 26.63,28.99 R19.1 | C10.P$2 7.38,37.53 C13.P$2 | 28.03,31.1 28.03,31.07 27.01,30.04 R19.1 | R19.1 | 33.62,15.94 arc-29 33.09,16.03 v33.06,15.91 33.1,15.78 arc-29 33.62,15.94 | 29.5,36.94 arc-29 29.98,36.69 v30.03,36.8 | 29.5,36.94 arc29 30.04,36.93 v30.03,36.8 | 30.59,36.8 arc-29 30.06,36.93 v30.03,36.8 | 30.59,36.8 arc29 30.06,36.68 v30.03,36.8 | 7.53,41.15 arc-29 8.05,41.02 v8.08,41.15 | 7.53,41.15 arc29 8.05,41.27 v8.08,41.15 | 9.53,28.11 arc-29 10.06,27.99 v10.09,28.11 | 9.53,28.11 arc29 10.05,28.24 v10.09,28.11 | 11.28,42.25 arc-29 11.45,41.74 v11.57,41.77 | 11.28,42.25 arc29 11.66,41.86 v11.57,41.77 | 11.56,3.92 arc-29 12.1,4 v12.08,4.12 | 11.56,3.92 arc29 12,4.23 v12.08,4.12 | 12.63,4.13 arc-29 12.1,4.25 v12.08,4.12 | 12.63,4.13 arc29 12.11,4 v12.08,4.12 | 16.08,4.13 arc-29 16.62,4.04 v16.64,4.16
  Top 0.4: 16.08,4.13 arc29 16.6,4.29 v16.64,4.16 | 19.55,6.22 arc-29 19.88,5.79 v19.98,5.86 20.04,5.97 arc-29 19.55,6.22 | 6.46,5.87 arc-29 7.02,4.63 CN2.2 | 6.46,5.87 arc29 7.8,5.6 CN2.2 | 8.82,3.92 arc-29 8.31,5.18 CN2.2 | 8.82,3.92 arc29 7.5,4.24 CN2.2 | Q5.4 9.75,18.13 R21.P$2 | R6.1 18.2,3.48 17.52,4.16 v16.64,4.16
  Top 0.5: C9.1 28.42,9.59 27.84,10.16 26.79,10.16 26.43,9.8 IC4.2 26.43,12.49 27.33,13.39 v27.89,13.39 27.95,13.45 C4.1 | C14.1 28.13,15.18 v27.86,15.18 | C5.P$1 C3.P$2 C2.P$2
  Top 0.6: v33.06,15.91 33.88,15.91 Q3.2 | Q5.4 9.71,17.33 v9.78,17.4 | U$53.P$5 U$53.P$6
  Top 0.8: U$24.P$1 28.15,17.67 | 28.15,18.64 28.15,17.67 | 28.15,17.67 C14.1 C4.1
  Top 1: 8.97,4.13 8.44,4.13 7.7,4.87 | 8.97,4.13 arc-29 7.95,5.2 CN2.2 7.55,4.53 arc-29 8.97,4.13 | C6.1 C1.1 | U1.6 U1.14 U1.13 U1.12 | U$16.P$1 8.97,4.13
  Bottom 0.4: v23.39,24.16 22.83,24.16 | 22.83,24.16 15.89,24.16 | 15.89,24.16 14.86,24.16 IC1.57 | IC1.57 14.63,24.93 15.22,25.52 | v17.82,28.12 17.43,27.73 | 17.43,27.73 15.22,25.52 | v8.08,41.15 8.49,41.15 8.62,41.01 | 8.62,41.01 9.46,40.18 | 9.46,40.18 IC8.17 | IC8.17 10.77,39.63 | 10.77,39.63 11.57,39.63 | 11.57,39.63 14.71,39.63 | 14.71,39.63 14.75,39.63 v15.12,40.01 | IC8.17 10.54,39.09 | 10.54,39.09 12.93,36.71 12.93,26.09 | 12.93,26.09 13.73,25.29 | 13.73,25.29 IC1.57 | v10.09,28.11 10.64,28.11 | 10.64,28.11 10.91,28.11 12.93,26.09 | v11.57,41.77 11.57,41.22 | 11.57,41.22 11.57,39.63 | 15.89,24.16 arc-29 14.95,24.83 IC1.57 | 15.89,24.16 arc29 14.78,23.85 IC1.57 | 15.22,25.52 arc-29 14.3,24.82 IC1.57 | 15.22,25.52 arc29 15.18,24.37 IC1.57 | 13.73,25.29 arc-29 14.12,24.2 IC1.57 | 13.73,25.29 arc29 14.82,24.9 IC1.57 | 17.43,27.73 arc-29 17.89,28.01 v17.82,28.12 | 17.43,27.73 arc29 17.71,28.19 v17.82,28.12 | 9.46,40.18 arc-29 9.77,39.52 IC8.17 | 9.46,40.18 arc29 10.11,39.86 IC8.17 | 10.77,39.63 arc-29 10.08,39.87 IC8.17 | 10.77,39.63 arc29 10.08,39.4 IC8.17 | 10.54,39.09 arc-29 10.23,39.74 IC8.17 | 10.54,39.09 arc29 9.89,39.41 IC8.17 | 14.71,39.63 arc-29 15.19,39.9 v15.12,40.01 | 14.71,39.63 arc29 15.02,40.08 v15.12,40.01 | 22.83,24.16 arc-29 23.36,24.04 v23.39,24.16 | 22.83,24.16 arc29 23.36,24.29 v23.39,24.16 | 8.62,41.01 arc-29 8.14,41.26 v8.08,41.15 | 8.62,41.01 arc29 8.08,41.02 v8.08,41.15 | 10.64,28.11 arc-29 10.11,28.24 v10.09,28.11 | 10.64,28.11 arc29 10.11,27.99 v10.09,28.11 | 11.57,41.22 arc-29 11.69,41.75 v11.57,41.77 | 11.57,41.22 arc29 11.45,41.75 v11.57,41.77
  Bottom 0.6: v27.86,15.18 28.59,15.91 v33.06,15.91 | v9.78,17.4 9.78,14.73 9.48,14.43
  Bottom 0.8: v20.61,17.1 20.5,17.21 v15.5,17.21 v15.49,17.21 12.26,17.21 9.48,14.43 5.78,10.73 5.78,6.27 6.34,5.7 | CN2.2 7.13,4.92 6.34,5.7 | 6.34,5.7 arc-29 7.28,4.6 CN2.2 | 6.34,5.7 arc29 7.76,5.41 CN2.2
  Bottom 1: 14.63,23.11 14.63,19.39 15.32,18.7 22.6,18.7 26.12,15.18 v27.86,15.18 29.16,16.47 v29.16,31.11 29.16,35.92 v30.03,36.8 | 14.63,23.11 IC1.57 | 14.63,23.11 arc-29 14.88,24.34 IC1.57 | 14.63,23.11 arc29 14.39,24.34 IC1.57
  Bottom 1.27: v27.86,15.18 27.86,5.27 27.51,4.92 | U$6.P$1 33.38,8.55 29.74,4.92 27.51,4.92 | 27.51,4.92 24.36,4.92 | 24.36,4.92 23.29,4.92 | 23.29,4.92 22.3,4.92 | 22.3,4.92 CN2.2 | U1.13 22.26,4.95 22.3,4.92 | U1.14 23.41,5.04 23.29,4.92 | U1.6 24.51,5.07 24.36,4.92
  other vias: 14.63,24.38 22.26,5.86 23.41,5.86 24.51,5.86 10,39.63 26.39,4.31 13.55,4.14 15.04,4.16 27.86,17 16.23,17.37 16.8,16.77 21.4,17.26 21.87,16.64 27.47,4.29 13.24,25.75 14.61,25.75 15.99,25.75 15.99,24.37 15.99,23 14.61,23 13.24,23 13.24,24.37
  pour Bottom: 7.21,4.4 9.32,2.28 28.46,2.28 34.2,8.02 34.2,9.45 34.04,9.61 32.71,9.61 32.5,9.4 32.5,8.8 30.95,7.25 30.25,7.25 29.63,7.86 29.63,14.22 30.57,15.16 33.2,15.16 33.59,15.55 33.59,16.44 33.28,16.74 30.12,16.74 29.65,17.21 29.65,35.19 30.94,36.48 30.94,37.12 30.21,37.85 28.78,37.85 28.42,37.48 28.42,18.84 27.14,17.57 24.53,17.57 22.9,19.2 15.54,19.2 15.22,19.53 15.22,20.51 17.16,22.45 22.74,22.45 24.25,23.96 24.25,24.64 23.88,25.01 18.85,25.01 18.3,25.56 18.3,28.32 18.08,28.54 16.97,28.54 13.46,32.05 13.46,37.65 15.69,39.87 15.69,40.44 15.3,40.82 13.23,40.82 11.36,42.69 8.69,42.69 7.49,41.48 7.49,40.28 10.75,37.03 10.75,34.25 12.46,32.54 12.46,30.55 10.54,28.63 9.72,28.63 9.41,28.33 9.41,20.72 11.99,18.14 21.52,18.14 24.71,14.95 24.71,11.56 20.57,7.42 10,7.42 8.25,5.67 7.61,5.67 7.22,5.28 7.22,4.42
  pour Top: 21.26,20.08 21.31,20.02 26.18,20.02 26.89,19.32 26.89,13.46 26.06,12.63 26.06,9.43 26.05,9.42 26.05,8.56 26.13,8.48 26.72,8.48 26.79,8.55 26.79,12.35 26.97,12.53 28.58,12.53 28.69,12.64 28.69,19.19 27.22,20.66 21.28,20.66 21.21,20.59 21.21,20.12 21.25,20.08
  pour Top: 21.47,23.79 21.53,23.74 23.96,23.74 24.22,23.99 24.22,24.62 24.12,24.72 21.69,24.72 21.47,24.5
  pour Bottom: 6.99,4.32 4.04,7.26 4.04,10.81 7.91,14.68 7.91,16.7 9.01,17.8 21.56,17.8 22.3,17.06 22.3,15.77 21.71,15.19 13.01,15.19 6.42,8.6 6.42,6.68 7.75,5.34 7.75,4.66 7.41,4.32
  pour Top: 20.4,16.66 20.09,16.97 20.09,17.57 20.3,17.79 21.56,17.79 22.28,17.07 22.28,16.41 22.12,16.25 21.7,16.25 21.5,16.45 21.5,16.62 21.34,16.78 20.87,16.78 20.75,16.66
  pour Top: 15.16,16.79 15.04,16.91 15.04,17.54 15.28,17.78 16.62,17.78 17.25,17.15 17.25,16.5 17.02,16.27 16.64,16.27 16.13,16.79
GPIO0
  Top 0.152: IC1.5 18.6,23.38 19.84,22.15 21.75,22.15 22.08,22.48 29.45,22.48 32.2,19.73 32.2,15.21 31.58,14.58 | U$6.P$6 31.58,14.58 | 31.58,14.58 arc-29 30.77,14.51 U$6.P$6 | 31.58,14.58 arc29 31.51,13.78 U$6.P$6
L45_2_CATHODE  (via drill 0.35)
  Top 0.152: IC10.7 23.51,28.46 23.86,28.8 23.86,29.54 25.62,31.3 25.62,40.24 23.18,42.68 23.18,47.18 | 23.18,47.18 v23.18,47.73 | 23.18,47.18 arc-29 23.4,47.62 v23.18,47.73 | 23.18,47.18 arc29 22.95,47.62 v23.18,47.73
  Bottom 0.4: U$18.CASODE 28.77,49.65 28.68,49.65 | 23.57,48.13 25.1,49.65 28.68,49.65 | 23.57,48.13 v23.18,47.73 | 23.57,48.13 arc-29 23.11,47.84 v23.18,47.73 | 23.57,48.13 arc29 23.29,47.67 v23.18,47.73 | 28.68,49.65 arc-29 29.51,49.94 U$18.CASODE | 28.68,49.65 arc29 29.07,50.44 U$18.CASODE
L45_CATHODE  (via drill 0.35)
  Top 0.152: IC10.9 22.55,29.11 25.01,31.57 25.01,39.85 20.8,44.06 20.59,44.06 | v20.04,44.06 20.59,44.06 | 20.59,44.06 arc-29 20.15,44.28 v20.04,44.06 | 20.59,44.06 arc29 20.15,43.84 v20.04,44.06
  Bottom 0.4: U$14.CASODE 13.19,44.07 | 13.19,44.07 19.48,44.07 | 19.48,44.07 20.02,44.07 v20.04,44.06 | 19.48,44.07 arc-29 20,43.94 v20.04,44.06 | 19.48,44.07 arc29 20.01,44.18 v20.04,44.06 | 13.19,44.07 arc-29 12.37,44.41 U$14.CASODE | 13.19,44.07 arc29 12.37,43.74 U$14.CASODE
L90_CATHODE  (via drill 0.35)
  Top 0.152: 21.34,43.06 24.7,39.69 24.7,31.7 22.7,29.69 22.29,29.69 22.09,29.48 IC10.10 | 21.34,43.06 21.17,43.22 v20.81,43.22 | 21.34,43.06 arc-29 20.98,43.4 v20.81,43.22 | 21.34,43.06 arc29 20.85,42.98 v20.81,43.22
  Bottom 0.4: U$44.CASODE 6.12,37.33 | 6.12,37.33 6.25,37.46 6.25,39.24 6.97,39.97 6.97,41.68 8.43,43.14 20.26,43.14 | v20.81,43.22 20.72,43.14 20.26,43.14 | 20.26,43.14 arc-29 20.8,43.1 v20.81,43.22 | 20.26,43.14 arc29 20.76,43.34 v20.81,43.22 | 6.12,37.33 arc-29 5.3,36.99 U$44.CASODE | 6.12,37.33 arc29 5.78,36.51 U$44.CASODE
LED_A0
  Top 0.2: IC1.13 18.59,26.58 18.98,26.98 18.98,27.44 19.6,28.06 IC10.15 | IC10.15
LED_A1
  Top 0.2: IC1.14 18.08,27.04 19.5,28.46 IC10.14
LED_A2
  Top 0.2: IC1.15 17.23,27.63 17.38,27.49 18.02,27.49 19.39,28.86 IC10.13
LED_EN
  Top 0.152: IC7.4 26.08,26.95 25.24,26.11 22.91,26.11 22.23,26.79 20.78,26.79 20.38,26.39 18.96,26.39 18.75,26.18 IC1.12
LED_SCL
  Top 0.2: IC1.21 14.83,29.03 13.37,30.49 13.37,39.96 13.38,39.96 13.38,40.78 R12.P$2
  Top 0.3: R12.P$2 13.54,42.73 14.12,43.32 IC2.15
LED_SDA
  Top 0.2: IC1.22 14.43,28.93 12.9,30.46 12.9,39.96 R13.P$1
  Top 0.3: IC2.14 13.98,43.82 12.92,42.76 R13.P$1
N$1
  Top 0.4: R10.2 35.41,14.98 35.41,18.11 U$13.+
  Top 0.6: U$13.+ 35.34,18.39 D1.1
N$2
  Top 0.25: IC6.8 IC6.3 21.12,13.49 22.76,11.86 U$7.P$1 23.61,11.36 U$8.P$1
  pour Top: 21.16,14.22 21.76,13.61 23.05,13.61 24.02,12.64 24.02,10.36 23.51,9.85 22.25,9.85 20.96,11.14 20.96,14.16 21.04,14.23 21.15,14.23
  pour Top: 20.92,16.58 20.92,13.51 21,13.44 21.27,13.44 21.34,13.5 21.34,16.54 21.28,16.6 20.94,16.6
N$3
  Top 0.4: 35.42,22.89 U$13.-
  Top 0.6: D1.2 34.53,22.17 35.25,22.89 35.42,22.89 | Q3.3 36.94,16.96 36.94,22.07 36.12,22.89 U$13.-
N$4
  Top 0.4: U$2.P$2 19.86,2.7 R6.2
N$6
  Top 0.3: R11.2 24.77,51.31 25.38,51.91 29.86,51.91 | U$18.ANODE 29.99,51.91 29.86,51.91 | 29.86,51.91 arc-29 30.7,52.12 U$18.ANODE | 29.86,51.91 arc29 30.22,52.69 U$18.ANODE
N$7
  Top 0.4: U$30.P$1 15.69,51.21 R33.1
N$8
  Top 0.152: 17.12,51.24 R32.1
  Top 0.4: U$23.P$1 17.12,51.24
N$9
  Top 0.152: R31.1
  Top 0.4: U$21.P$1 R31.1
N$10
  Top 0.4: U$19.P$1 R30.1
N$11
  Top 0.152: 21.12,51.24 R28.1
  Top 0.4: U$25.P$1 21.12,51.24
N$12
  Top 0.3: U$22.ANODE 7.83,52.12 8.29,52.12 | R14.2 12.15,51.31 11.34,52.12 8.29,52.12 | 8.29,52.12 arc-29 7.74,52.79 U$22.ANODE | 8.29,52.12 arc29 7.42,52.12 U$22.ANODE
N$13
  Top 0.25: U$1.P$1 19.24,11.38 U$7.P$2
N$14
  Top 0.152: 22.44,51.21 R27.1
  Top 0.4: U$31.P$1 22.44,51.21
N$15
  Top 0.25: U$53.P$7 4.97,19.72 5.78,18.92 5.78,12.93 R7.P$1
  Top 0.5: Q2.3 6.94,13.26 R7.P$1
N$16
  Top 0.4: 27.73,11.29 IC4.4
  Top 0.5: C9.2 27.73,11.29
N$17
  Top 0.5: CN2.1 7.17,7.95 7.17,8.91 | 7.17,8.91 Q2.4 6.32,11.51 R7.P$2 | 7.17,8.91 arc-29 7.01,7.53 CN2.1 | 7.17,8.91 arc29 8.13,7.91 CN2.1
  pour Top: 6.95,6.62 5.22,8.34 5.22,11.18 5.22,11.55 5.47,11.8 6.87,11.8 7.54,11.13 7.54,9.41 8.55,8.4 8.55,6.95 8.26,6.67 8.19,6.6 6.95,6.6
N$18
  Top 0.3: 13.75,47.6 R29.2
  Top 0.5: U$14.ANODE 12.85,46.7 13.44,47.29 | 13.44,47.29 13.75,47.6 | 13.44,47.29 arc-29 12.68,46.8 U$14.ANODE | 13.44,47.29 arc29 13.14,46.44 U$14.ANODE
N$19
  Top 0.3: U$10.ANODE 24.5,47.34 | 24.5,47.34 24.25,47.59 R15.2 | 24.5,47.34 arc-29 24.78,46.53 U$10.ANODE | 24.5,47.34 arc29 25.31,47.06 U$10.ANODE
N$20
  Top 0.4: R25.2 2.04,36.67 | 2.04,36.67 2.56,36.67 U$44.ANODE | 2.04,36.67 arc-29 2.67,36.04 U$44.ANODE | 2.04,36.67 arc29 2.93,36.66 U$44.ANODE
N$21
  Top 0.3: U$4.ANODE 36,36.3 | 36,36.3 36.46,36.3 R26.2 | 36,36.3 arc-29 35.22,36.67 U$4.ANODE | 36,36.3 arc29 35.22,35.92 U$4.ANODE
N$22
  Top 0.6: U$11.P$1 U$3.P$2
N$24
  Top 0.152: 15.88,14.09 IC5.3
  Top 0.25: U$3.P$1 16.25,12.49 15.88,12.86 15.88,14.09 | IC5.3 IC5.8
  Top 0.6: U$3.P$1 U$9.P$1
  pour Top: 15.79,13.79 15.79,9.92 15.81,9.89 17.02,9.89 17.51,10.39 17.51,12.38 15.99,13.9 15.9,13.9
  pour Top: 15.66,16.56 15.66,13.52 15.75,13.42 16.05,13.42 16.14,13.52 16.14,16.54 16.06,16.62 15.71,16.62
N$25
  Top 0.4: R19.2 27.01,27.43 26.34,28.1 IC7.5
N$26
  Top 0.4: U1.11 19.68,7.22 R5.P$1
N$27
  Top 0.152: IC5.1 IC5.10 14.88,16.04 14.88,16.63
  Top 0.25: IC5.1 14.88,16.04 | IC5.10 14.88,16.63 U$27.P$1
  pour Top: 13.62,16.51 13.78,16.35 14.33,16.35 14.55,16.13 14.55,13.61 14.7,13.46 15,13.46 15.07,13.52 15.07,16.63 14.38,17.33 13.71,17.33 13.62,17.24
N$28
  Top 0.25: U$17.P$1 19.01,17.45 20.11,16.35 20.11,15.93 IC6.10 IC6.1
  pour Top: 18.63,16.24 18.63,17.44 18.72,17.53 19.3,17.53 20.34,16.48 20.34,13.45 20.27,13.38 19.98,13.38 19.79,13.57 19.79,15.95 19.57,16.16 18.71,16.16
N$29
  Top 0.4: Q5.6 Q5.5 Q5.2 Q5.1 | Q5.6 Q5.1 | Q5.1 11.77,15.66 U$58.P$1 | D2.2 8.95,15.06 Q5.6
  pour Top: 9.18,14.29 8.28,15.19 8.28,16.65 8.37,16.74 12.71,16.74 12.76,16.69 12.76,14.71 12.71,14.66 11.95,14.66 11.58,15.02 10.61,15.02 9.87,14.29
N$32
  Top 0.152: IC7.7 IC7.2
  Top 0.2: IC10.6 24.41,28.06 IC7.2 | IC10.6
N$34
  Top 0.3: C10.P$1 8.25,38.63 IC8.8
N$45
  Top 0.3: C7.P$1 16.32,41.36 IC2.3
N$46
  Top 0.3: C7.P$2 16.82,42.06 IC2.4
N$47
  Top 0.3: C11.P$1 17.92,42.82 IC2.5
N$48
  Top 0.3: C11.P$2 18.72,43 18.41,43.32 IC2.6
N$49
  Top 0.152: 19.91,43.04 C16.P$1
  Top 0.3: 19.91,43.04 19.91,43.07 19.15,43.82 IC2.7
  Top 0.305: IC2.17 16.32,43.82 IC2.7
N$50
  Top 0.3: IC2.8 18.92,44.32 22.44,47.83 U$31.P$2
N$51
  Top 0.3: IC2.13 14.75,44.32 14.87,44.44 14.87,47.51 15.69,48.33 U$30.P$2
N$54
  Top 0.3: IC2.12 15.32,47.27 17.12,49.07 U$23.P$2
N$55
  Top 0.3: IC2.11 15.82,47.04 18.1,49.32 U$21.P$2
N$56
  Top 0.3: IC2.10 16.32,46.9 18.07,48.64 19.11,48.64 19.79,49.32 U$19.P$2
N$57
  Top 0.3: IC2.9 16.82,46.76 18.25,48.19 20.02,48.19 21.12,49.3 U$25.P$2
R45_2_CATHODE  (via drill 0.35)
  Top 0.152: 21.11,44.3 25.31,40.1 25.31,31.43 23.14,29.25 IC10.8 | 21.11,44.3 20.77,44.65 v20.67,44.65 | 21.11,44.3 arc-29 20.9,44.75 v20.67,44.65 | 21.11,44.3 arc29 20.63,44.4 v20.67,44.65
  Bottom 0.4: v20.67,44.65 20.41,44.65 20.32,44.74 20.12,44.74 | 20.12,44.74 16.29,44.74 10.99,50.04 9.55,50.04 | 9.55,50.04 8.87,50.04 U$22.CASODE | 20.12,44.74 arc-29 20.62,44.53 v20.67,44.65 | 20.12,44.74 arc29 20.67,44.77 v20.67,44.65 | 9.55,50.04 arc-29 8.84,50.58 U$22.CASODE | 9.55,50.04 arc29 8.67,49.93 U$22.CASODE
R45_CATHODE  (via drill 0.35)
  Top 0.152: 25.06,29.97 25.92,30.83 25.92,43.26 | 25.06,29.97 v24.66,29.58 v24.67,29.57 | 25.92,43.26 25.92,44.07 U$10.CASODE | 25.06,29.97 arc-29 24.59,29.81 v24.67,29.57 | 25.06,29.97 arc29 24.91,29.5 v24.67,29.57 | 25.92,43.26 arc-29 26.24,44.02 U$10.CASODE | 25.92,43.26 arc29 25.41,43.9 U$10.CASODE
  Top 0.2: IC10.5 v23.46,27.33
  Bottom 0.3: v23.46,27.33 23.46,27.89 | 23.46,27.89 23.46,28.39 24.26,29.19 | v24.67,29.57 24.64,29.57 24.26,29.19 | 23.46,27.89 arc-29 23.29,27.39 v23.46,27.33 | 23.46,27.89 arc29 23.63,27.39 v23.46,27.33 | 24.26,29.19 arc-29 24.74,29.41 v24.67,29.57 | 24.26,29.19 arc29 24.52,29.65 v24.67,29.57
R90_CATHODE  (via drill 0.35)
  Top 0.152: v25.68,29.69 26.07,30.08 | 26.07,30.08 26.27,30.28 26.27,32.12 30.42,36.28 31.65,36.28 | U$4.CASODE 32.16,36.28 31.65,36.28 | 26.07,30.08 arc-29 25.6,29.93 v25.68,29.69 | 26.07,30.08 arc29 25.92,29.61 v25.68,29.69 | 31.65,36.28 arc-29 32.46,36.17 U$4.CASODE | 31.65,36.28 arc29 32.14,36.94 U$4.CASODE
  Top 0.2: IC10.4 22.48,27.1 22.92,26.66 24.05,26.66 | 24.05,26.66 v24.6,26.66 | 24.05,26.66 arc-29 24.51,26.46 v24.6,26.66 | 24.05,26.66 arc29 24.51,26.87 v24.6,26.66
  Bottom 0.3: v24.6,26.66 24.6,27.22 | 24.6,27.22 24.6,28.58 25.3,29.28 | 25.3,29.28 25.68,29.66 v25.68,29.69 | 24.6,27.22 arc-29 24.43,26.72 v24.6,26.66 | 24.6,27.22 arc29 24.77,26.72 v24.6,26.66 | 25.3,29.28 arc-29 25.77,29.54 v25.68,29.69 | 25.3,29.28 arc29 25.52,29.76 v25.68,29.69
RXD  (via drill 0.35)
  Top 0.152: v15.71,19.7 15.61,19.7 15.27,20.04 | 15.27,20.04 14.83,20.48 IC1.50 | U$6.P$2 32.75,11.3 32.39,10.94 | 32.39,10.94 31.5,10.05 30.37,10.05 29.67,10.75 29.67,11.76 29.19,12.25 29.19,19.46 26.86,21.79 23.23,21.79 | 23.23,21.79 22.88,21.79 v22.7,21.61 | 15.27,20.04 arc-29 15.48,19.59 v15.71,19.7 | 15.27,20.04 arc29 15.76,19.95 v15.71,19.7 | 23.23,21.79 arc-29 22.73,21.86 v22.7,21.61 | 23.23,21.79 arc29 22.88,21.43 v22.7,21.61 | 32.39,10.94 arc-29 33.15,10.67 U$6.P$2 | 32.39,10.94 arc29 32.79,11.64 U$6.P$2
  Bottom 0.4: v15.71,19.7 16.11,20.09 | 16.11,20.09 17.62,21.61 22.14,21.61 | 22.14,21.61 v22.7,21.61 | 16.11,20.09 arc-29 15.64,19.81 v15.71,19.7 | 16.11,20.09 arc29 15.82,19.63 v15.71,19.7 | 22.14,21.61 arc-29 22.67,21.48 v22.7,21.61 | 22.14,21.61 arc29 22.67,21.73 v22.7,21.61
SEN_L45  (via drill 0.35)
  Top 0.2: v25.4,50.34 25.58,50.16 R4.P$2
  Top 0.3: IC8.2 10.25,41.77 9,43.02 9,48.34 6.45,50.89 6.45,52.79 7.92,54.25 8.24,54.25 10.39,56.39 26.35,56.39 28.82,53.93 | Q10.1 29.36,53.38 28.82,53.93 | 28.82,53.93 arc-29 29.04,53.2 Q10.1 | 28.82,53.93 arc29 29.5,53.6 Q10.1
  Bottom 0.4: v25.4,50.34 25.8,50.73 | 25.8,50.73 28.36,53.3 28.53,53.3 | 28.53,53.3 Q10.1 | 25.8,50.73 arc-29 25.34,50.44 v25.4,50.34 | 25.8,50.73 arc29 25.51,50.27 v25.4,50.34 | 28.53,53.3 arc-29 29.26,53.03 Q10.1 | 28.53,53.3 arc29 29.26,53.57 Q10.1
SEN_L45_2
  Top 0.3: IC8.16 11.9,40.38 12.47,40.96 12.47,42.94 13.1,43.58 13.1,44.98 11.95,46.14 | Q4.1 11.5,46.58 11.95,46.14 | 11.95,46.14 arc-29 11.84,46.89 Q4.1 | 11.95,46.14 arc29 11.31,46.56 Q4.1
  Top 0.4: Q4.1 11.64,46.97 11.64,47.66 | 11.64,47.66 R17.P$2 | 11.64,47.66 arc-29 11.25,46.98 Q4.1 | 11.64,47.66 arc29 11.78,46.89 Q4.1
SEN_L90
  Top 0.3: R18.P$2 6.62,40.38 IC8.5
  Top 0.4: Q1.1 5.23,38.75 | 5.23,38.75 5.23,38.99 R18.P$2 | 5.23,38.75 arc-29 4.96,38.02 Q1.1 | 5.23,38.75 arc29 5.5,38.02 Q1.1
SEN_R45
  Top 0.2: R16.P$2 25.87,49.5 25.88,49.5 26.13,49.75 26.13,50.41 26.28,50.55 27.27,50.55 28.69,49.13
  Top 0.3: IC8.3 9.75,41.62 7.15,44.22 6.59,44.22 5.78,45.04 5.78,52.79 7.69,54.71 8.06,54.71 10.22,56.87 27.57,56.87 31.53,52.91 31.53,50.66 30,49.13 28.69,49.13
  Top 0.4: Q8.1 25.9,47.51 | 25.9,47.51 25.58,47.82 R16.P$2 | 25.9,47.51 arc-29 26.22,46.8 Q8.1 | 25.9,47.51 arc29 26.6,47.19 Q8.1
SEN_R45_2
  Top 0.3: IC8.1 10.75,41.91 9.45,43.21 9.45,50.05 9.59,50.18 | R20.P$2 11.53,49.68 10.56,50.66 | 10.56,50.66 10.23,50.98 Q11.1 | Q11.1 9.8,50.39 9.59,50.18 | 10.56,50.66 arc-29 10.04,51.21 Q11.1 | 10.56,50.66 arc29 9.8,50.65 Q11.1 | 9.59,50.18 arc-29 10.06,50.77 Q11.1 | 9.59,50.18 arc29 9.46,50.93 Q11.1
SEN_R90
  Top 0.3: 31.92,38.01 R22.P$2 30.97,42.73 32.24,44 32.24,52.84 27.75,57.33 10.03,57.33 7.87,55.16 7.5,55.16 5.32,52.98 5.32,44.84 6.41,43.76 6.94,43.76 9.25,41.45 IC8.4 | 31.92,38.01 32.68,38.01 Q7.1 | 31.92,38.01 arc-29 32.59,37.65 Q7.1 | 31.92,38.01 arc29 32.63,38.26 Q7.1
SPI_L_CLK  (via drill 0.35)
  Top 0.2: IC1.25 13.23,28.53 10.65,31.11 v10.12,31.11 U$15.P$5
  Top 0.3: v11.56,32.63 11.56,38.82 IC8.13
  Bottom 0.4: v11.56,32.63 11.56,32.55 v10.12,31.11
SPI_L_IN  (via drill 0.35)
  Top 0.152: U$15.P$3 9.57,29.11 | 9.57,29.11 v10.12,29.11 | 9.57,29.11 arc-29 10.01,28.88 v10.12,29.11 | 9.57,29.11 arc29 10.01,29.33 v10.12,29.11
  Top 0.2: 10.68,29.12 11.63,29.12 12.43,28.32 IC1.27 | 10.68,29.12 10.14,29.12 v10.12,29.11 | 10.68,29.12 arc-29 10.21,29.32 v10.12,29.11 | 10.68,29.12 arc29 10.22,28.9 v10.12,29.11
  Top 0.3: v10.84,33.12 10.75,33.21 10.75,33.67 | 10.75,33.67 IC8.12 | 10.75,33.67 arc-29 10.66,33.15 v10.84,33.12 | 10.75,33.67 arc29 10.99,33.2 v10.84,33.12
  Bottom 0.4: v10.12,29.11 10.12,29.15 9.75,29.52 | 9.75,29.52 9.44,29.83 9.44,31.73 10.44,32.73 | 10.44,32.73 v10.84,33.12 | 9.75,29.52 arc-29 10.01,29.05 v10.12,29.11 | 9.75,29.52 arc29 10.2,29.21 v10.12,29.11 | 10.44,32.73 arc-29 10.9,33.01 v10.84,33.12 | 10.44,32.73 arc29 10.73,33.19 v10.84,33.12
SPI_L_OUT  (via drill 0.35)
  Top 0.152: U$15.P$4 9.57,30.11 | 9.57,30.11 v10.12,30.11 | 9.57,30.11 arc-29 10.01,29.88 v10.12,30.11 | 9.57,30.11 arc29 10.01,30.33 v10.12,30.11
  Top 0.2: IC1.26 12.83,28.42 11.14,30.11 10.68,30.11 | 10.68,30.11 v10.12,30.11 | 10.68,30.11 arc-29 10.22,30.32 v10.12,30.11 | 10.68,30.11 arc29 10.22,29.9 v10.12,30.11
  Top 0.3: IC8.14 11.98,39.38 12.26,39.1 12.26,32.21 | v11.91,31.78 12.26,32.12 12.26,32.21 | 12.26,32.21 arc-29 11.81,31.92 v11.91,31.78 | 12.26,32.21 arc29 12.08,31.72 v11.91,31.78
  Bottom 0.4: 11.53,31.37 11.86,31.7 11.86,31.73 v11.91,31.78 | 11.53,31.37 10.59,30.42 | 10.59,30.42 10.27,30.11 v10.12,30.11 | 10.59,30.42 arc-29 10.08,30.23 v10.12,30.11 | 10.59,30.42 arc29 10.22,30.02 v10.12,30.11 | 11.53,31.37 arc-29 11.98,31.67 v11.91,31.78 | 11.53,31.37 arc29 11.8,31.84 v11.91,31.78
SUCTION_PWM
  Top 0.152: R21.P$1 10.75,19.02 9.17,20.6 9.17,22.25 9.51,22.58 IC1.40
  Top 0.4: Q5.3 10.75,18.13 R21.P$1
SW1
  Top 0.152: 11.15,22.98 IC1.39
  Top 0.2: 11.15,22.98 10.7,22.98 10.6,23.08 R8.P$1
  Top 0.4: U$43.P$1 3.09,14.36 3.09,16.03 2.07,17.05 2.07,21.16 3.08,22.17 8.19,22.17 9.1,23.08 R8.P$1
TXD  (via drill 0.35)
  Top 0.152: v16.78,19.68 16.39,19.29 | 16.39,19.29 16.15,19.06 15.57,19.06 14.43,20.19 IC1.49 | U$6.P$4 30.09,9.5 | 30.09,9.5 29.37,10.23 29.37,11.64 28.88,12.12 28.88,19.33 26.99,21.22 24.09,21.22 | 24.09,21.22 v23.54,21.22 v23.53,21.22 | 16.39,19.29 arc-29 16.86,19.44 v16.78,19.68 | 16.39,19.29 arc29 16.54,19.76 v16.78,19.68 | 24.09,21.22 arc-29 23.64,21.44 v23.53,21.22 | 24.09,21.22 arc29 23.64,21 v23.53,21.22 | 30.09,9.5 arc-29 30.16,8.7 U$6.P$4 | 30.09,9.5 arc29 30.89,9.43 U$6.P$4
  Bottom 0.4: v23.53,21.22 23.51,21.22 23.22,20.93 23.05,20.93 | v16.78,19.68 17.17,20.07 | 17.17,20.07 18.02,20.93 23.05,20.93 | 17.17,20.07 arc-29 16.71,19.79 v16.78,19.68 | 17.17,20.07 arc29 16.89,19.61 v16.78,19.68 | 23.05,20.93 arc-29 23.57,21.1 v23.53,21.22 | 23.05,20.93 arc29 23.44,21.31 v23.53,21.22
VCC
  Top 0.25: U$5.P$2 15.38,8.73 IC5.2 | IC6.2 20.62,10.17 18.06,7.6 16.8,7.6 | 10.95,14.24 10.95,13.93 U$20.P$1 11,13.88 D2.1
  Top 0.3: Q2.5 Q2.2
  Top 0.4: R2.P$1 8.12,14.48 Q2.2 | U$16.P$2 U$5.P$2 U$12.P$2 | 10.06,10.14 9.54,10.66 Q2.6 | Q2.1 9.98,13.26 10.95,14.24 | U$2.P$1 21.82,3.72 U1.3
  Top 0.5: Q2.5 Q2.6 | Q2.1 Q2.2
  Top 0.6: U1.1 19.85,4.16 16.8,7.2 16.8,7.6 U$12.P$2
  Top 1: U1.5 U1.4 U1.3 U1.1
  pour Top: 9.39,7.08 9.39,8.16 7.72,9.84 7.72,14.75 7.82,14.85 8.36,14.85 8.54,14.67 8.54,14.32 8.76,14.1 9.92,14.1 10.67,14.86 11.43,14.86 11.52,14.76 11.52,12.82 11.21,12.51 11.21,10.1 11.6,9.71 13.28,9.71 13.51,9.94 13.51,11.9 14.85,13.24 15.46,13.24 15.59,13.11 15.59,9.81 15.72,9.68 19.81,9.68 19.95,9.82 19.95,12.83 20.52,13.39 20.74,13.39 20.78,13.35 20.78,9.59 18.79,7.6 18.32,7.6 18.32,5.92 10.55,5.92